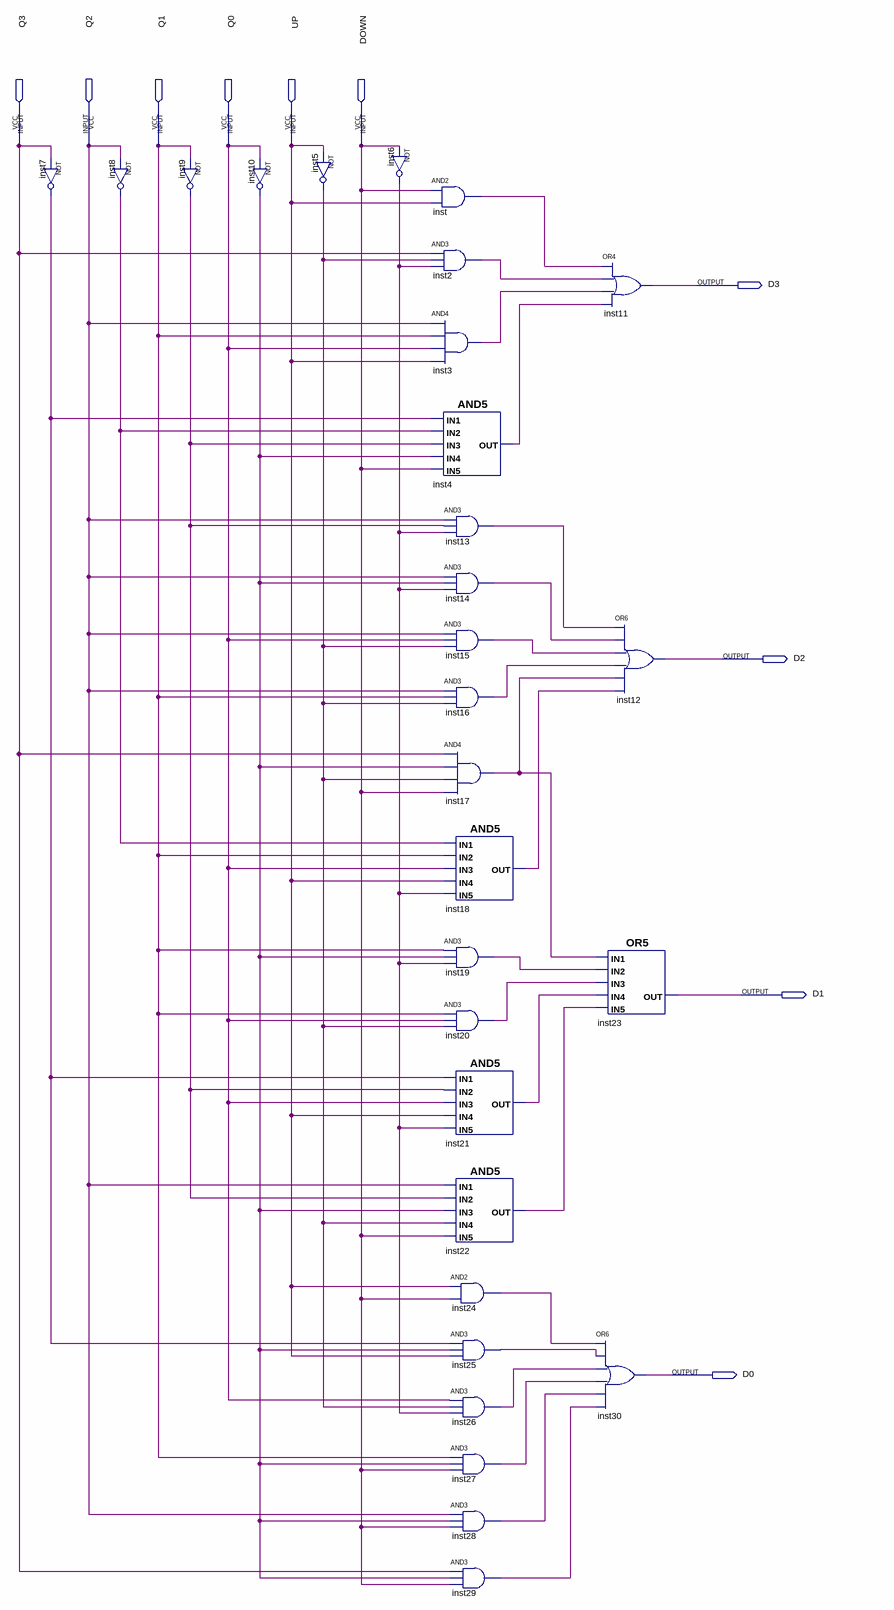
[diagram p0: schematic sheet]
// Quartus schematic ProximoEstado.bdf as structural Verilog: 30 symbols, 10 pins
module ProximoEstado (
  input  Q3,
  input  Q2,
  input  Q1,
  input  Q0,
  input  UP,
  input  DOWN,
  output D3,
  output D2,
  output D1,
  output D0
);

  wire inst2_out, inst3_out, inst4_out, inst5_out, inst6_out, inst7_out, inst8_out, inst9_out, inst10_out,
       inst13_out, inst14_out, inst15_out, inst16_out, inst17_out, inst18_out, inst19_out, inst20_out,
       inst21_out, inst22_out, inst24_out, inst25_out, inst26_out, inst27_out, inst28_out, inst29_out,
       inst_out;

  not inst7 (inst7_out, Q3);
  not inst8 (inst8_out, Q2);
  not inst9 (inst9_out, Q1);
  not inst10 (inst10_out, Q0);
  not inst5 (inst5_out, UP);
  not inst6 (inst6_out, DOWN);
  and inst (inst_out, DOWN, UP);
  and inst2 (inst2_out, Q3, inst5_out, inst6_out);
  and inst3 (inst3_out, Q2, Q1, Q0, UP);
  and inst4 (inst4_out, inst7_out, inst8_out, inst9_out, inst10_out, DOWN);
  and inst13 (inst13_out, Q2, inst9_out, inst6_out);
  and inst14 (inst14_out, Q2, inst10_out, inst6_out);
  and inst15 (inst15_out, Q2, Q0, inst5_out);
  and inst16 (inst16_out, Q2, Q1, inst5_out);
  and inst17 (inst17_out, Q3, inst10_out, inst5_out, DOWN);
  and inst18 (inst18_out, inst8_out, Q1, Q0, UP, inst6_out);
  and inst19 (inst19_out, Q1, inst10_out, inst6_out);
  and inst20 (inst20_out, Q1, Q0, inst5_out);
  and inst21 (inst21_out, inst7_out, inst9_out, Q0, UP, inst6_out);
  and inst22 (inst22_out, Q2, inst9_out, inst10_out, inst5_out, DOWN);
  and inst24 (inst24_out, UP, DOWN);
  and inst25 (inst25_out, inst7_out, inst10_out, UP);
  and inst26 (inst26_out, Q0, inst5_out, inst6_out);
  and inst27 (inst27_out, Q1, inst10_out, DOWN);
  and inst28 (inst28_out, Q2, inst10_out, DOWN);
  and inst29 (inst29_out, Q3, inst10_out, DOWN);
  or inst23 (D1, inst17_out, inst19_out, inst20_out, inst21_out, inst22_out);
  or inst30 (D0, inst24_out, inst25_out, inst26_out, inst27_out, inst28_out, inst29_out);
  or inst11 (D3, inst_out, inst2_out, inst3_out, inst4_out);
  or inst12 (D2, inst13_out, inst14_out, inst15_out, inst16_out, inst17_out, inst18_out);
endmodule
